# Altium schematic sheet MP2019_LDO_5V.SchDoc: MP2019_LDO_5V@300mA
size A4; Author: Andrés Gullón; DocumentNumber: 5; Revision: 1.G.3; SheetNumber: 5; SheetTotal: 6
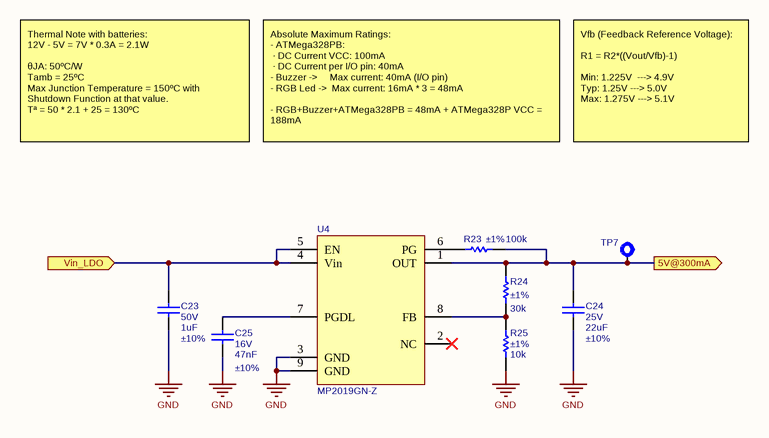
[diagram p0: MP2019_LDO_5V.SchDoc]

## Parts
C23  Voltage: 50V  Capacitance: 1uF  Tolerance: ±10%  [C0805]  (hidden comment: C0805_1uF_50V_±10%_X7R)
C24  Voltage: 25V  Capacitance: 22uF  Tolerance: ±10%  [C1206]  (hidden comment: C1206_22uF_25V_±10%)
C25  Voltage: 16V  Capacitance: 47nF  Tolerance: ±10%  [C0402]  (hidden comment: C0402_47nF_16V_±10%)
R23  Tolerance: ±1%  Resistance: 100k  [R0402]  (hidden comment: R0402_100k_0.063W_±1%)
R24  Tolerance: ±1%  Resistance: 30k  [R0402]  (hidden comment: R0402_30k_0.063W_±1%)
R25  Tolerance: ±1%  Resistance: 10k  [R0402]  (hidden comment: R0402_10k_0.063W_±1%)
TP7  TP  [TP_POWER]  (value not drawn)  (no BOM)
U4  MP2019GN-Z  [SOIC8 EP]

## Ports
5V@300mA (out), Vin_LDO (in)

## Nets
GND: C23.1 C24.1 C25.1 R25.2 U4.3(GND) U4.9(GND)
5V@300mA: C24.2 R23.1 R24.2 TP7.1 U4.1(OUT) ; port 5V@300mA
Vin_LDO: C23.2 U4.4(Vin) U4.5(EN) ; port Vin_LDO
NetC25_2: C25.2 U4.7(PGDL)
NetR23_2: R23.2 U4.6(PG)
NetR24_1: R24.1 R25.1 U4.8(FB)

Not connected (* = marked no-connect by the designer): U4 2(NC)*

## Notes on the sheet
- Thermal Note with batteries:
  12V - 5V = 7V * 0.3A = 2.1W
  θJA: 50ºC/W
  Tamb = 25ºC
  Max Junction Temperature = 150ºC with Shutdown Function at that value.
  Tª = 50 * 2.1 + 25 = 130ºC
- Absolute Maximum Ratings:
  - ATMega328PB:
  · DC Current VCC: 100mA
  · DC Current per I/O pin: 40mA
  - Buzzer ->     Max current: 40mA (I/O pin)
  - RGB Led ->  Max current: 16mA * 3 = 48mA
  - RGB+Buzzer+ATMega328PB = 48mA + ATMega328P VCC = 188mA
- Vfb (Feedback Reference Voltage):
  R1 = R2*((Vout/Vfb)-1)
  Min: 1.225V  ---> 4.9V
  Typ: 1.25V ---> 5.0V
  Max: 1.275V ---> 5.1V
- Title
- Project
- Size:
- Author
- A4
- Number:
- Revision:
- Mundo Reader, S.L. This project and all the sheets and layouts enclosed are licensed under Creative Commons by Attribution and Share Alike [CC BY-SA] (www.creativecommons.com)
- Date:
- Time:
- Sheet
- of

## Library data of the parts
C23 = CMP-A0195-2: Manufacturer: Kemet; Dielectric: X7R; Value: 1uF ±10% 50V; OrderingCode: C0805C105K5RAC; Temp_ Max: 125; Temp_ Min: -55; Description ES: Condensador; SchLibComponentName: Capacitor; Part Number: C0805_1uF_50V_±10%_X7R; Price units: EUR
C24 = CMP-A0110-1: Manufacturer: Murata; Dielectric: X5R; Value: 22uF ±10% 25V; OrderingCode: GRM31CR61E226KE15L; Temp_ Max: 85; Temp_ Min: -55; SchLibComponentName: Capacitor; Part Number: C1206_22uF_25V_±10%; Price units: EUR
C25 = CMP-A0571-1: Manufacturer: Kemet; Dielectric: X7R; Value: 47nF ±10% 16V; OrderingCode: C0402C473K4RAC; Temp_ Max: 125; Temp_ Min: -55; SchLibComponentName: Capacitor; Part Number: C0402_47nF_16V_±10%; Price units: EUR
R23 = CMP-A1835-1: Manufacturer: Vishay; Value: 100k ±1% 0.063W; OrderingCode: CRCW0402100KFK; Power: 0.063W; Temp_ Max: 155; Temp_ Min: -55; SchLibComponentName: Resistor; PackageDescription: SMD; Part Number: R0402_100k_0.063W_±1%; Price units: EUR
R24 = CMP-A1912-2: Manufacturer: Vishay; Value: 30k ±1% 0.063W; OrderingCode: CRCW040230K0FK; Power: 0.063W; Temp_ Max: 155; Temp_ Min: -55; Description ES: Resistencia; SchLibComponentName: Resistor; PackageDescription: SMD; Part Number: R0402_30k_0.063W_±1%; Price units: EUR
R25 = CMP-A1837-1: Manufacturer: Vishay; Value: 10k ±1% 0.063W; OrderingCode: CRCW040210K0FK; Power: 0.063W; Temp_ Max: 155; Temp_ Min: -55; SchLibComponentName: Resistor; PackageDescription: SMD; Part Number: R0402_10k_0.063W_±1%; Price units: EUR
TP7 = CMP-A2499-3: Testpoint 0.3mm; Manufacturer: Oxley; OrderingCode: SMOX/060/B1; SAP: 303552; SchLibComponentName: Testpoint; Part Number: TP_POWER; Price units: EUR
U4 = CMP-00392-2: LDO Vin: 3-40V Vout: 1.2-15V @300mA; Manufacturer: Monolithic Power Systems; Temp_Max: 150; Temp_Min: -40; Description ES: LDO Vin: 3-40V Vout: 1.2-15V @300mA; OrderingCode: MP2019GN-Z; Part Number: MP2019GN-Z; Price units: 10000; SchLibComponentName: MP2019